# Altium schematic sheet POWER.SchDoc
size 420 x 297 mm; SheetNumber: 4; SheetTotal: 7
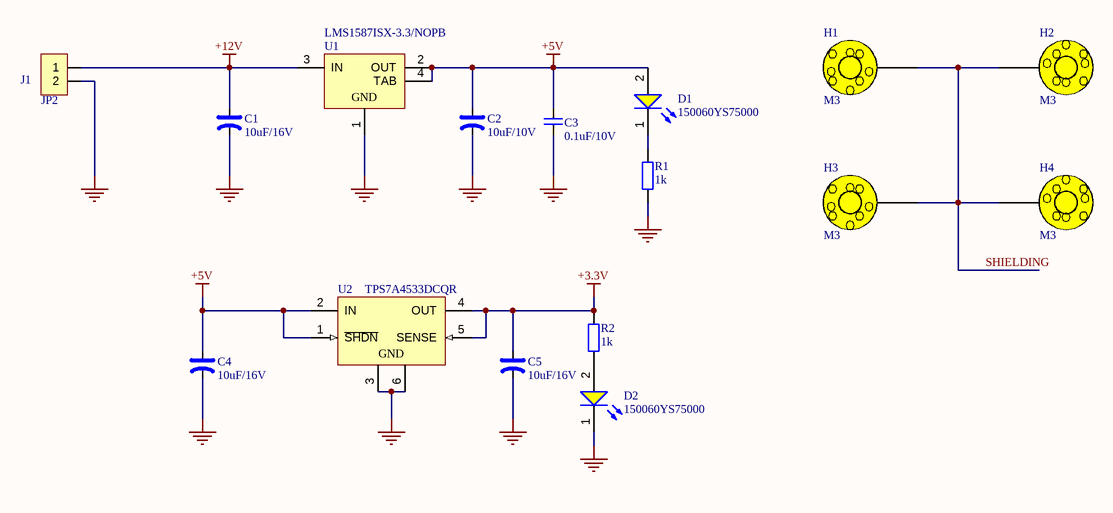
[diagram p0: POWER.SchDoc]

## Parts
C1  10uF/16V  [CAP_MP_2012X170]
C2  10uF/10V  [CAP_MP_2012X170]
C3  0.1uF/10V  [CAP_C_1608X80]
C4  10uF/16V  [CAP_MP_2012X170]
C5  10uF/16V  [CAP_MP_2012X170]
D1  150060YS75000  [WL-SMCW_0603_150060xx75000]
D2  150060YS75000  [WL-SMCW_0603_150060xx75000]
H1  M3  [HEX-M3]
H2  M3  [HEX-M3]
H3  M3  [HEX-M3]
H4  M3  [HEX-M3]
J1  JP2  [JP2-D1T]
R1  1k  [RES_C_1608X60]
R2  1k  [RES_C_1608X60]
U1  LMS1587ISX-3.3/NOPB  [TS3B_L]
U2  TPS7A4533DCQR  [DCQ0006A_M]

## Nets
+3.3V: C5.1 R2.2 U2.4(OUT) U2.5(SENSE)
+5V: C2.1 C3.1 C4.1 D1.2(A) U1.2(OUT) U1.4(TAB) U2.1(~{SHDN}) U2.2(IN)
+12V: C1.1 J1.1 U1.3(IN)
GND: C1.2 C2.2 C3.2 C4.2 C5.2 D2.1(K) J1.2 R1.2 U1.1(GND) U2.3(GND) U2.6(GND)
SHIELDING: H1.1 H2.1 H3.1 H4.1
NetD1_1: D1.1(K) R1.1
NetD2_2: D2.2(A) R2.1

## Notes on the sheet
- Sub-system:
- Project:
- Design by:
- Sheet title:
- Sheet
- of
- Checked by:
- Approved by:
- Doc No:
- Revision:
- Size:
- Date:
- A3

## Library data of the parts
C1 C2 C4 C5 = CAP_TH: CAP_Polarization; Published: 8-Jun-2000; LatestRevisionDate: 17-Jul-2002; LatestRevisionNote: Re-released for DXP Platform.; PackageReference: POLAR0.8; Publisher: Altium Limited
C3 = CAP_SMD: CAP_Chip; Value: 33pF
D1 D2 = CMP-1426-00005-2: LED YELLOW CLEAR 0603 SMD; NexarPartId: 29687085; Wavelength: 590nm; Luminous Intensity: 120mcd; Peak Wavelength: 595nm; Forward Current: 100mA; Power Dissipation: 72mW; Forward Voltage: 2V; Test Current: 20mA; Reverse Voltage: 5V; Lens Style: Clear, Rectangular; Max Junction Temperature (Tj): 95°C; Viewing Angle: 140°; Case Code (Imperial): 0603; Height: 700µm; REACH SVHC: Unknown; Dominant Wavelength: 590nm; Min Operating Temperature: -40°C; Color: Yellow; Width: 800µm; Mount: Surface Mount; Packaging: Tape and Reel; Max Operating Temperature: 85°C; RoHS: Compliant; Max Reverse Voltage (DC): 5V; Case Code (Metric): 1608; Length: 1.6mm; Case/Package: 0603
H1-H4 = HEX-M3
J1 = JP2: WR-PHD 2.54 mm Angled Socket Header; Manufacturer: W¨¹rth Elektronik eiSos GmbH; partNo: 613002143121; ComponentLink1 Description: Manufacturer; ComponentLink2 Description: Datasheet; NoPins: 02; Created Date: 29 March 2013; ComponentLink1URL: http://www.we-online.com; ComponentLink2URL: http://katalog.we-online.de/em/datasheet/6130xx143121.pdf; Created by: Karrer Zheng
R1 R2 = Tro 0603 1% 10k: RES; Chung_Loai: Dán; Don_Vi: Con; So_Chan: 2; Ten_Linh_Kien: Trở 0603 1% 10k; Ma_Hang: MH006333; Kieu_Chan: *
U1 = CMP-0062-00180-3: 3A Low Dropout Fast Response Regulators, 3-pin TO-263, Pb-Free; Manufacturer: National Semiconductor; PowerWise: N; High-Reliability: Y; PackageTopMarking: NSUZXYTTE#*LMS1587*IS-3.3; CompType: LDO IC; ComponentLink1Description: Manufacturer URL; PackageReference: TS3B; ComponentLink1URL: http://www.national.com/; ComponentLink2URL: http://www.national.com/ds/LM/LMS1587.pdf; DatasheetVersion: Jun-2005; ComponentLink3URL: http://www.national.com/pf/LM/LMS1587.html; PartNumber: LMS1587ISX-3.3/NOPB; RevisionNote: SCH symbol layout adjusted; PinCount: 3; RoHS: Y; Code_JEDEC: MO-169-AA; PackageDescription: TO-263, Molded, .400 x .390 x .180in, 3 Lead, .1in Pitch, Surface Mount; ComponentLink4Description: TS3B Package Page; ComponentLink3Description: LMS1587 Web Page; PackageVersion: revF, Apr-2005; ComponentLink2Description: LMS1587 Datasheet; ComponentLink4URL: http://www.national.com/packaging/folders/ts3b.html
U2 = CMP-0395-00360-2: Single Output Fast Transient Response LDO, 1.5 A, Fixed 3.3 V Output, 2.1 to 20 V Input, 6-pin SOT-223 (DCQ), -40 to 125 degC, Green (RoHS & no Sb/Br); Manufacturer: Texas Instruments; Vout Adj(Max)(V): 3.3; Vin(Max)(V): 20; Accuracy(%): 1; SubFamily: Single Channel LDO; Vin(Min)(V): 2.1; Iout(Max)(A): 1.5; Vdo(Typ)(mV): 300; Eco-Plan: Green (RoHS & no Sb/Br); Mounting Technology: Surface Mount; PackageDescription: 6-Pin Plastic Small Outline, Body 3.5 x 6.5 mm, Pitch 1.27 mm; ComponentLink2URL: http://www.ti.com/general/docs/lit/getliterature.tsp?genericPartNumber=TPS7A4533&fileType=pdf; PackageReference: DCQ0006A; ComponentLink3Description: Package Specification; ComponentLink2Description: Datasheet; Fixed Output Options(V): 3.3; Iq(Typ)(mA): 1; ComponentLink1URL: http://www.ti.com/; PartNumber: TPS7A4533DCQR; ComponentLink1Description: Manufacturer URL; PackageVersion: 4202109/D; Vout Adj(Min)(V): 3.3; DatasheetVersion: SLVS720D; ComponentLink3URL: http://www.ti.com/litv/pdf/mpds098c